# EAGLE schematic GIP-CCS811 (EAGLE 9.1.3)
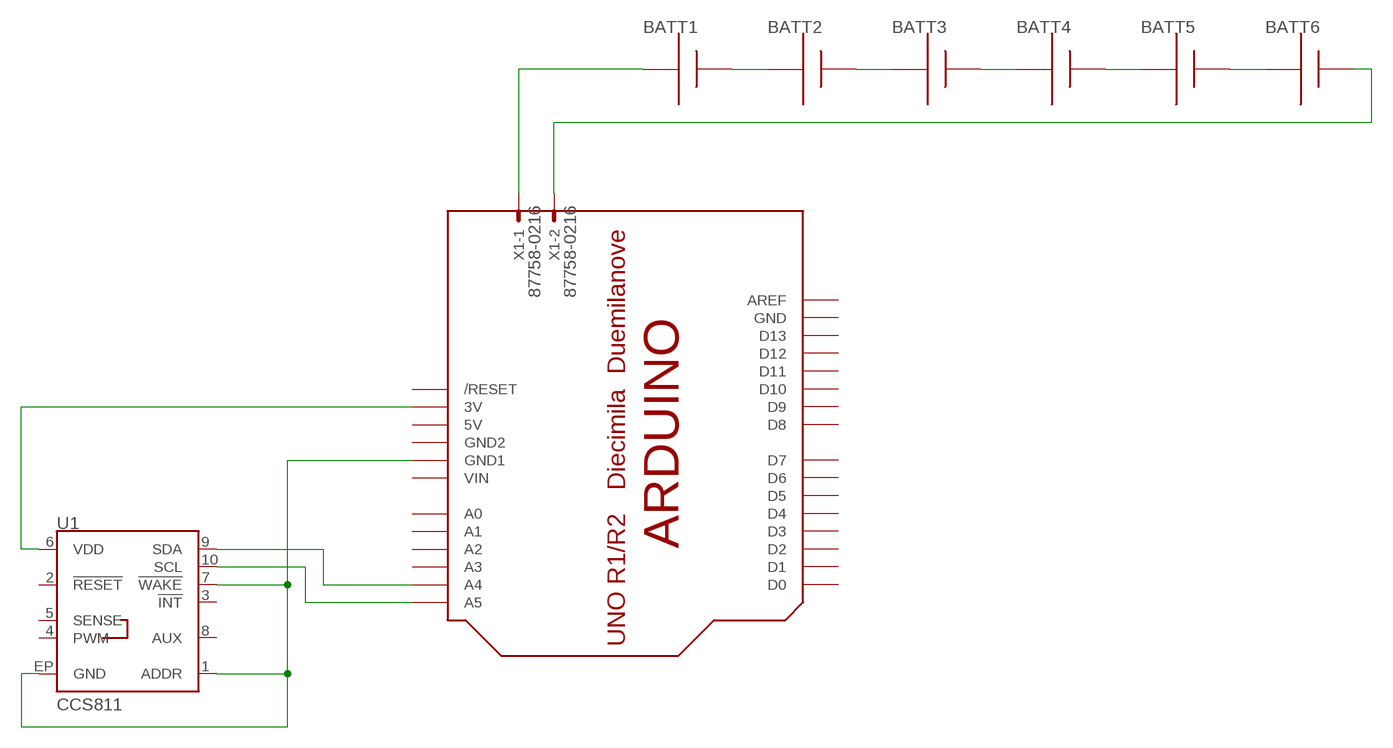
[diagram p0: schematic, sheet 1]

## Parts
BATT1  AAA  [12BH412]
BATT2  AAA  [12BH412]
BATT3  AAA  [12BH412]
BATT4  AAA  [12BH412]
BATT5  AAA  [12BH412]
BATT6  AAA  [12BH412]
U1  CCS811  [LGA10]
U$1  ARDUINO-BPLACE  [ARDUINO-BPLACE]
X1  87758-0216  [87758-0216]

## Nets
N$1: U1.9(SDA) U$1.A4
N$2: U1.10(SCL) U$1.A5
N$3: U1.6(VDD) U$1.3V
N$4: U1.1(ADDR) U1.7(!WAKE!) U1.EP(GND) U$1.GND1
N$5: BATT1.+ BATT2.-
N$6: BATT2.+ BATT3.-
N$7: BATT3.+ BATT4.-
N$8: BATT4.+ BATT5.-
N$9: BATT5.+ BATT6.-
N$10: BATT1.- X1.1
N$11: BATT6.+ X1.2
Unconnected: U1.2(!RESET!) U1.3(!INT!) U1.4(PWM) U1.5(SENSE) U1.8(AUX) U$1.A0 U$1.A1 U$1.A2 U$1.A3 U$1.AREF U$1.D0 U$1.D1 U$1.D2 U$1.D3 U$1.D4 U$1.D5 U$1.D6 U$1.D7 U$1.D8 U$1.D9 U$1.D10 U$1.D11 U$1.D12 U$1.D13 U$1.RESET(/RESET)

## Power pins joined to a net without a drawn wire
5V: U$1.5V
GND: U$1.GND
GND2: U$1.GND2
VIN: U$1.VIN

## Library data of the parts
BATT1-BATT6 = adafruit:AAA: AAA PC pin holder Mouser part #12BH412 - but pretty much any 1x AAA battery holder should be the same http://www.ladyada.net/library/pcb/eaglelibrary.html
U1 = CCS811_Breakout_Temp:CCS811: AMS CCS811 – I2C Digital Gas Sensor Ultra-Low Power Digital Gas Sensor for Monitoring Indoor Air Quality AMS Product Page <http://ams.com/eng/Products/Environmental-Sensors/Gas-Sensors/CCS811> SparkFun Products:; PROD_ID: IC-13607
U$1 = adafruit:ARDUINO: Arduino Diecimila/Duemilanove Make a shield with ease, this package has all the named pins as well as the two mounting drill holes and an outline of the USB and DC power connector. The outline is on the DIMENSION layer, so if your board house uses it they will cut the outline to match. http://www.ladyada.net/library/pcb/eaglelibrary.html
X1 = con-molex:87758-0216: 2 Pin - 2mm Dual Row Single Wafer, Vertical T/H HDR Source: http://www.molex.com/pdm_docs/sd/877580616_sd.pdf; MF: MOLEX; MPN: 87758-0216; OC_FARNELL: unknown; OC_NEWARK: 94M1513